# Altium schematic sheet uMultimeter_BUZZER_Sch.SchDoc: MicroMultimeter - Buzzer
size 127 x 101 mm; Author: Hom; CompanyName: KitSprout; DrawnBy: Hom; Engineer: Hom; Organization: KitSprout; Revision: B; SheetNumber: 1; SheetTotal: 1; License: CC BY-SA 4.0; Version: 2.0; LibVersion: 2.1; PageSetup: Record=PageOptions|CenterHorizontal=True|CenterVertical=True|PrintScale=1.00|XCorrection=1.00|YCorrection=1.00|PrintKind=0|BorderSize=5000000|LeftOffset=0|BottomOffset=0|Orientation=2|PaperLength=1000|PaperWidth=1000|Scale=100|PaperSource=7|PrintQuality=-3|MediaType=1|DitherType=10|PrintScaleMode=0|PaperKind=A4|PaperIndex=9
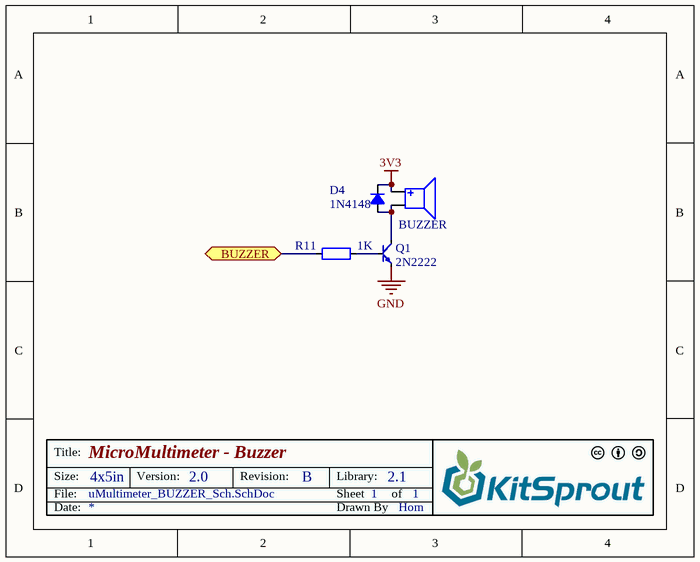
[diagram p0: uMultimeter_BUZZER_Sch.SchDoc]

## Parts
BUZZER  Buzzer  [Buzzer_5x5]  (value not drawn)
D4  value 1N4148  [SOD-323]  (hidden comment: Diode_SOD323)
Q1  value 2N2222  [SOT23-3]  (hidden comment: BJT_NPN)
R11  value 1K  [RES_0603]  (hidden comment: Res_0603)

## Ports
BUZZER

## Nets
3V3: BUZZER.P(Positive) D4.2(K)
GND: Q1.2(E)
BUZZER: R11.2 ; port BUZZER
NetBUZZER_N: BUZZER.N(Negative) D4.1(A) Q1.3(C)
NetQ1_1: Q1.1(B) R11.1

## Notes on the sheet
- Title:
- Size:
- Date:
- File:
- 4x5in
- Version:
- Revision:
- Sheet
- Drawn By
- Library:
- of

## Library data of the parts
D4 = Diode_SOD323: Diode
Q1 = BJT_NPN: Transistor
R11 = Res_0603: Resistor